# EasyEDA schematic SCH_angle-sensor_2024-07-24.json
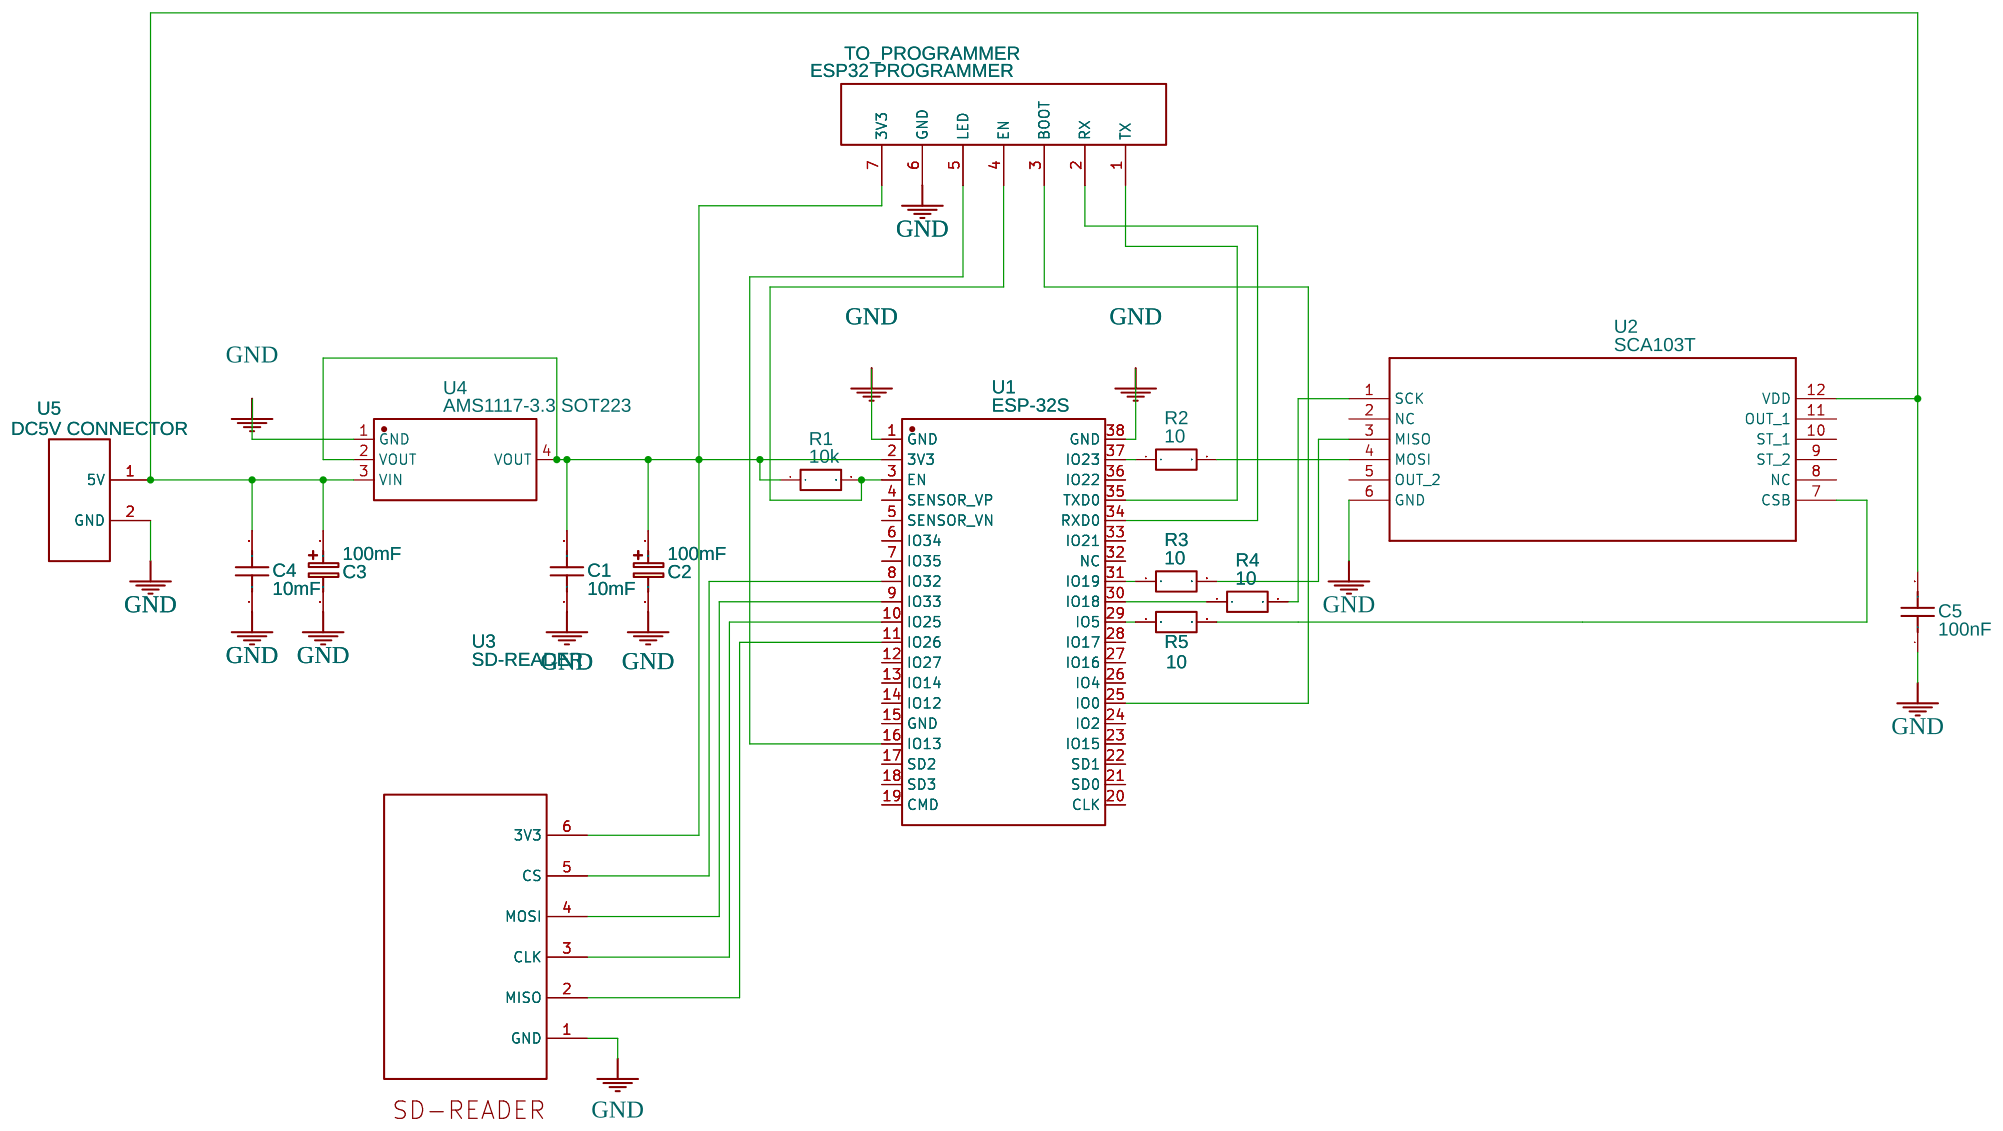
[diagram p0: schematic sheet]

## Parts
C1  10mF  [C0603]
C2  100mF  [CAP-5*7]
C3  100mF  [CAP-5*7]
C4  10mF  [C0603]
C5  100nF  [C0603]
R1  10k  [R0603]
R2  10  [R0603]
R3  10  [R0603]
R4  10  [R0603]
R5  10  [R0603]
TO_PROGRAMMER  ESP32 PROGRAMMER  [ESP32 PROGRAMMER]
U1  ESP-32S  [BULETM-SMD_ESP-32S]
U2  SCA103T  [SCA103T]
U3  SD-READER  [SD-READER]
U4  AMS1117-3.3 SOT223  [AMS1117-3.3]
U5  DC5V CONNECTOR  [DC5V CONNECTOR]

## Library data of the parts
C1 C4 C5 = C_0603_US: Contributor: LCEDA_Lib
C2 C3 = C_Tan_SMD_A_EU: Contributor: LCEDA_Lib
R1-R5 = R_0603_EU: Contributor: LCEDA_Lib
TO_PROGRAMMER = ESP32 PROGRAMMER: Contributor: heckfytwitch
U1 = ESP-32S: Contributor: LCSC; Supplier: LCSC; Supplier Part: C9900008045; Manufacturer: null
U2 = SCA103T: null; Contributor: heckfytwitch
U3 = SD-READER: Contributor: heckfytwitch
U4 = AMS1117-3.3 SOT223: Contributor: La Ode Muhamad Idris
U5 = DC5V CONNECTOR: Contributor: heckfytwitch

## Nets
GND: C1.1 C2.2 C3.2 C4.1 C5.1 TO_PROGRAMMER.6(GND) U1.1(GND) U1.38(GND) U2.6(GND) U3.1(GND) U4.1(GND) U5.2(GND)
Net-(C1-2): C1.2 C2.1 R1.1 TO_PROGRAMMER.7(3V3) U1.2(3V3) U3.6(3V3) U4.2(VOUT) U4.4(VOUT)
Net-(C3-1): C3.1 C4.2 C5.2 U2.12(VDD) U4.3(VIN) U5.1(5V)
Net-(R1-2): R1.2 TO_PROGRAMMER.4(EN) U1.3(EN)
Net-(R2-1): R2.1 U1.37(IO23)
Net-(R2-2): R2.2 U2.4(MOSI)
Net-(R3-1): R3.1 U1.31(IO19)
Net-(R3-2): R3.2 U2.3(MISO)
Net-(R4-1): R4.1 U1.30(IO18)
Net-(R4-2): R4.2 U2.1(SCK)
Net-(R5-1): R5.1 U1.29(IO5)
Net-(R5-2): R5.2 U2.7(CSB)
Net-(TO_PROGRAMMER-1): TO_PROGRAMMER.1(TX) U1.35(TXD0)
Net-(TO_PROGRAMMER-2): TO_PROGRAMMER.2(RX) U1.34(RXD0)
Net-(TO_PROGRAMMER-3): TO_PROGRAMMER.3(BOOT) U1.25(IO0)
Net-(TO_PROGRAMMER-5): TO_PROGRAMMER.5(LED) U1.16(IO13)
Net-(U1-8): U1.8(IO32) U3.5(CS)
Net-(U1-9): U1.9(IO33) U3.4(MOSI)
Net-(U1-10): U1.10(IO25) U3.3(CLK)
Net-(U1-11): U1.11(IO26) U3.2(MISO)

Not connected (* = marked no-connect by the designer): U1 4(SENSOR_VP) 5(SENSOR_VN) 6(IO34) 7(IO35) 12(IO27) 13(IO14) 14(IO12) 15(GND) 17(SD2) 18(SD3) 19(CMD) 20(CLK) 21(SD0) 22(SD1) 23(IO15) 24(IO2) 26(IO4) 27(IO16) 28(IO17) 32(NC) 33(IO21) 36(IO22); U2 2(NC) 5(OUT_2) 8(NC) 9(ST_2) 10(ST_1) 11(OUT_1)
